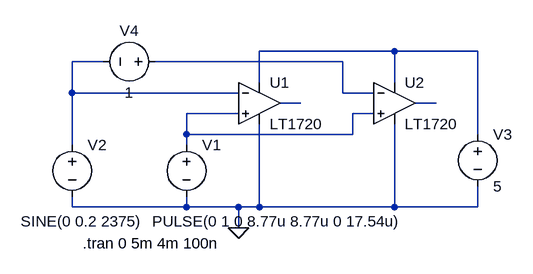
[diagram p0: schematic RDS Modulation 1.asc]
RDS Modulation 1.asc, the LTspice schematic file:
Version 4
SHEET 1 880 680
WIRE 416 0 208 0
WIRE 544 0 416 0
WIRE -32 16 -80 16
WIRE 336 16 48 16
WIRE 208 48 208 0
WIRE 416 48 416 0
WIRE -80 64 -80 16
WIRE 176 64 -80 64
WIRE 336 64 336 16
WIRE 384 64 336 64
WIRE 272 80 240 80
WIRE 480 80 448 80
WIRE 176 96 96 96
WIRE 384 96 352 96
WIRE 96 128 96 96
WIRE 352 128 352 96
WIRE 352 128 96 128
WIRE 544 128 544 0
WIRE -80 144 -80 64
WIRE 96 144 96 128
WIRE -80 240 -80 224
WIRE 96 240 96 224
WIRE 96 240 -80 240
WIRE 176 240 96 240
WIRE 208 240 208 112
WIRE 208 240 176 240
WIRE 416 240 416 112
WIRE 416 240 208 240
WIRE 544 240 544 208
WIRE 544 240 416 240
WIRE 176 272 176 240
FLAG 176 272 0
SYMBOL voltage 96 128 R0
WINDOW 123 0 0 Left 2
WINDOW 39 0 0 Left 2
WINDOW 3 -53 134 Left 2
SYMATTR InstName V1
SYMATTR Value PULSE(0 1 0 8.77u 8.77u 0 17.54u)
SYMBOL voltage -80 128 R0
WINDOW 123 0 0 Left 2
WINDOW 39 0 0 Left 2
WINDOW 3 -79 134 Left 2
SYMATTR InstName V2
SYMATTR Value SINE(0 0.2 2375)
SYMBOL Comparators\\LT1720 208 16 R0
SYMATTR InstName U1
SYMBOL voltage 544 112 R0
WINDOW 123 0 0 Left 2
WINDOW 39 0 0 Left 2
SYMATTR InstName V3
SYMATTR Value 5
SYMBOL Comparators\\LT1720 416 16 R0
SYMATTR InstName U2
SYMBOL voltage 64 16 R90
WINDOW 0 -32 56 VBottom 2
WINDOW 3 32 56 VTop 2
WINDOW 123 0 0 Left 2
WINDOW 39 0 0 Left 2
SYMATTR InstName V4
SYMATTR Value 1
TEXT -64 296 Left 2 !.tran 0 5m 4m 100n

The netlist it stands for:
* RDS Modulation 1.asc
V1 N006 0 PULSE(0 1 0 8.77u 8.77u 0 17.54u)
V2 N002 0 SINE(0 0.2 2375)
XU1 N006 N002 N001 0 N004 LT1720  ; pins In+ In- V+ V- OUT
V3 N001 0 5
XU2 N006 N003 N001 0 N005 LT1720  ; pins In+ In- V+ V- OUT
V4 N003 N002 1
.tran 0 5m 4m 100n
.lib LT1720.sub
.backanno
.end